# EAGLE design optical meter reader v3 (EAGLE 7.5.0)
Optical meter reader for Sensus water meters.
Assembly variants: Battery powered

## Sheet 1 of 2
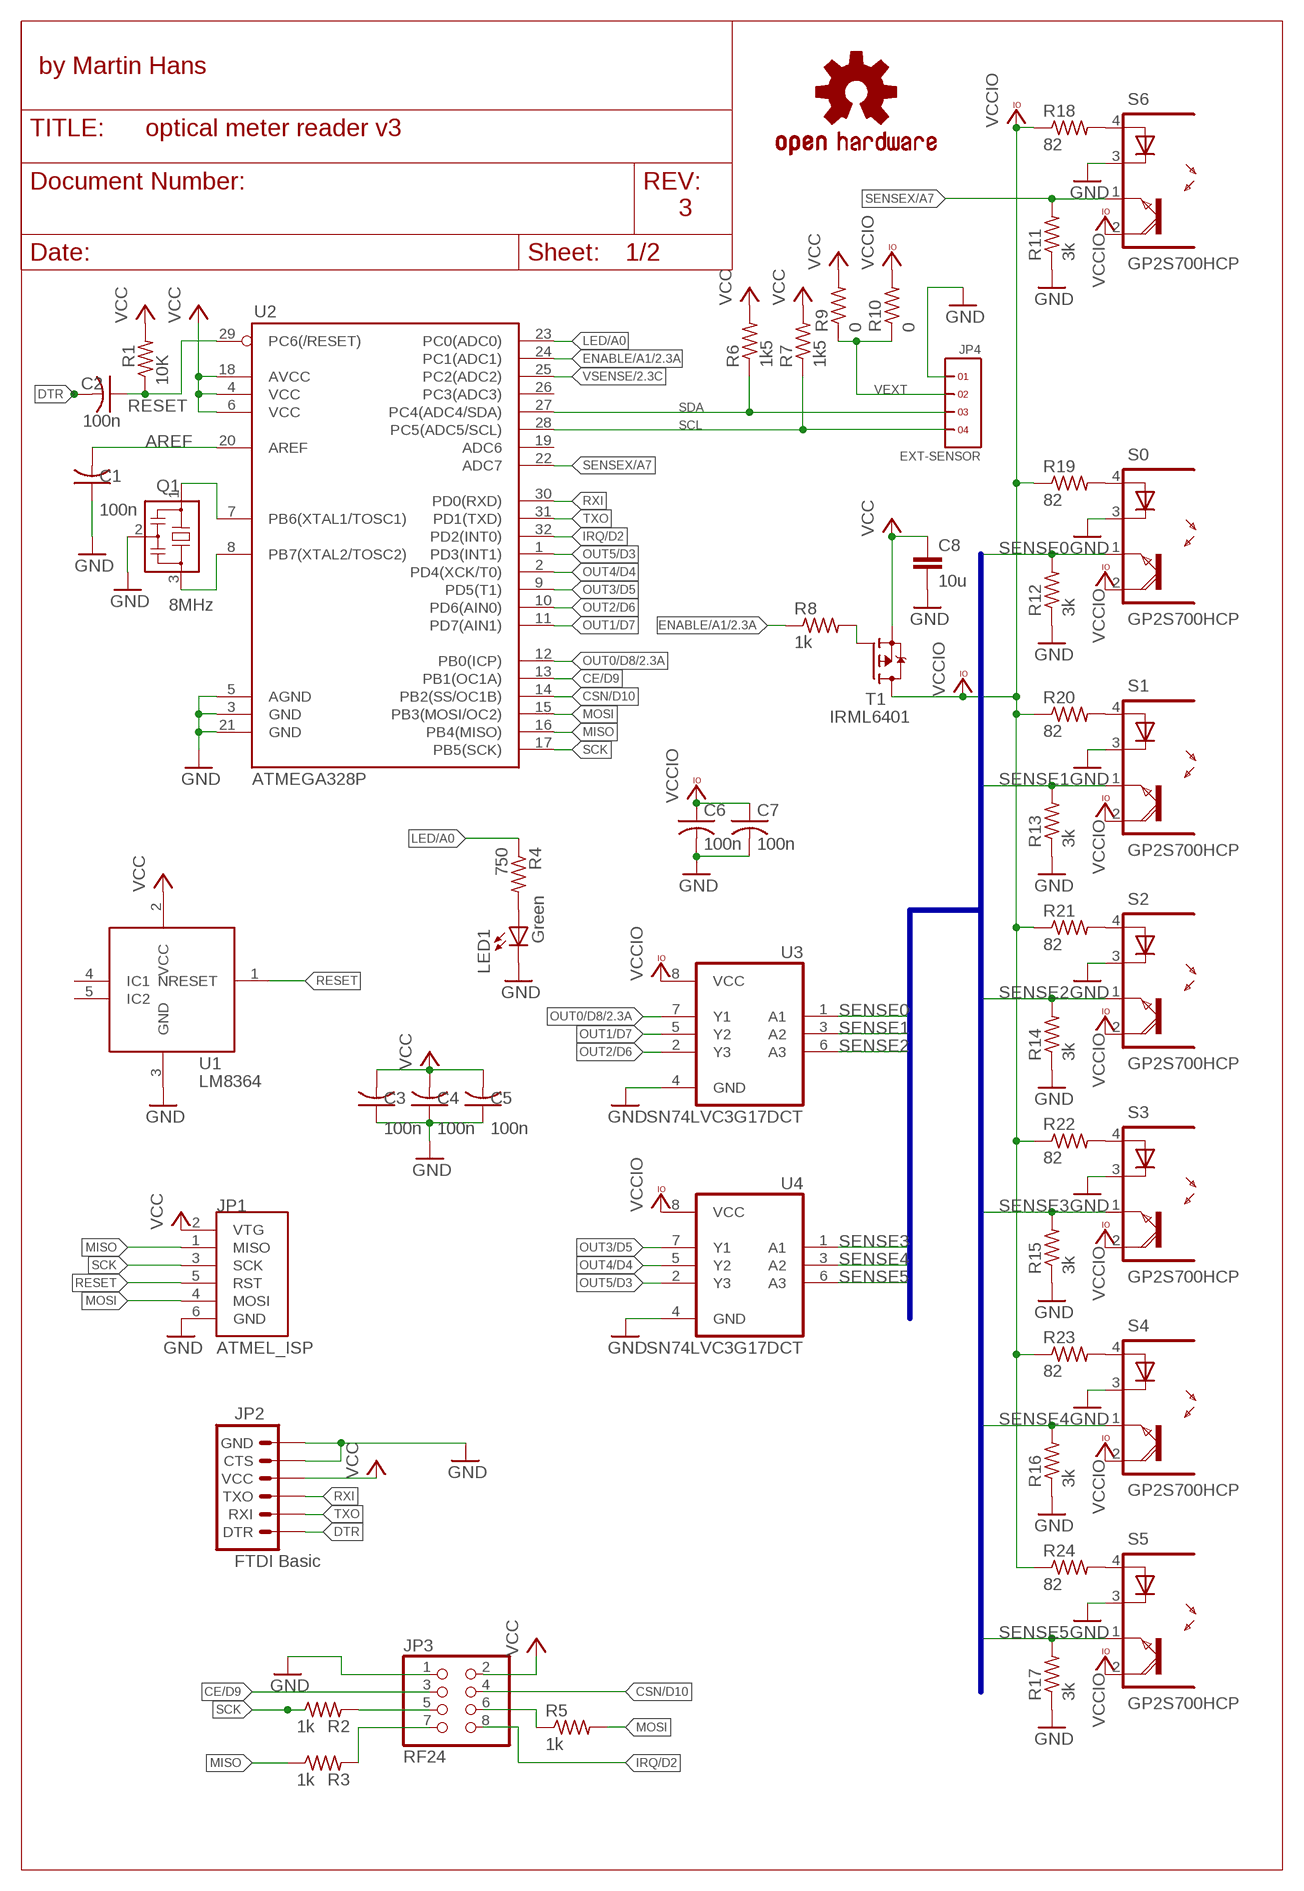
[diagram p0: schematic, sheet 1]

### Parts
C1  100n  C-USC0603  [C0603]
C2  100n  C-USC0603  [C0603]
C3  100n  C-USC0603  [C0603]
C4  100n  C-USC0603  [C0603]
C5  100n  C-USC0603  [C0603]
C6  100n  C-USC0603  [C0603]
C7  100n  C-USC0603  [C0603]
C8  10u  C-EUC0603  [C0603]
JP1  ATMEL_ISP  [2X03]  (not fitted in variant Battery powered)
JP2  FTDI Basic  ARDUINO_SERIAL_PROGRAMPTH  [1X06]
JP3  RF24  PINHD-2X4  [2X04]
JP4  EXT-SENSOR  1X4  [1X4]  (not fitted in variant Battery powered)
LED1  Green  LED  [0603-LED-ALT1]
LOGO1  OSHW-LOGOL  [OSHW-LOGO-L]
Q1  8MHz  CSTCE  [CSTCE]
R1  10K  R-US_R0603  [R0603]
R2  1k  R-US_R0603  [R0603]
R3  1k  R-US_R0603  [R0603]
R4  750  R-US_R0603  [R0603]
R5  1k  R-US_R0603  [R0603]
R6  1k5  R-US_R0603  [R0603]  (not fitted in variant Battery powered)
R7  1k5  R-US_R0603  [R0603]  (not fitted in variant Battery powered)
R8  1k  R-US_R0603  [R0603]
R9  0  R-US_R0603  [R0603]  (not fitted in variant Battery powered)
R10  0  R-US_R0603  [R0603]  (not fitted in variant Battery powered)
R11  3k  R-US_R0603  [R0603]  (not fitted in variant Battery powered)
R12  3k  R-US_R0603  [R0603]
R13  3k  R-US_R0603  [R0603]
R14  3k  R-US_R0603  [R0603]
R15  3k  R-US_R0603  [R0603]
R16  3k  R-US_R0603  [R0603]
R17  3k  R-US_R0603  [R0603]
R18  82  R-US_R0603  [R0603]  (not fitted in variant Battery powered)
R19  82  R-US_R0603  [R0603]
R20  82  R-US_R0603  [R0603]
R21  82  R-US_R0603  [R0603]
R22  82  R-US_R0603  [R0603]
R23  82  R-US_R0603  [R0603]
R24  82  R-US_R0603  [R0603]
S0  GP2S700HCP  [SMD]
S1  GP2S700HCP  [SMD]
S2  GP2S700HCP  [SMD]
S3  GP2S700HCP  [SMD]
S4  GP2S700HCP  [SMD]
S5  GP2S700HCP  [SMD]
S6  GP2S700HCP  [SMD]  (not fitted in variant Battery powered)
T1  IRML6401  [SOT23]
U1  LM8364  [SOT23-DBV]
U2  ATMEGA328P  ATMEGA168  [TQFP32-08]
U3  SN74LVC3G17DCT  SN743G17DCT  [SSOP08]
U4  SN74LVC3G17DCT  SN743G17DCT  [SSOP08]

### Nets
AREF: C1.2 U2.20(AREF)
CE/D9: JP3.3 U2.13(PB1(OC1A))
CSN/D10: JP3.4 U2.14(PB2(SS/OC1B))
DTR: C2.2 JP2.1(DTR)
ENABLE/A1: R8.1 U2.24(PC1(ADC1)) ; also sheet 2
GND: C1.1 C3.1 C4.1 C5.1 C6.2 C7.2 C8.2 JP1.6(GND) JP2.5(CTS) JP2.6(GND) JP3.1 JP4.1 LED1.C Q1.2 R11.1 R12.1 R13.1 R14.1 R15.1 R16.1 R17.1 S0.3(C) S1.3(C) S2.3(C) S3.3(C) S4.3(C) S5.3(C) S6.3(C) U1.3(GND) U2.3(GND) U2.5(AGND) U2.21(GND) U3.4(GND) U4.4(GND) ; also sheet 2
IRQ/D2: JP3.8 U2.32(PD2(INT0))
LED/A0: R4.1 U2.23(PC0(ADC0))
MISO: JP1.1(MISO) R3.1 U2.16(PB4(MISO))
MOSI: JP1.4(MOSI) R5.2 U2.15(PB3(MOSI/OC2))
N$1: R19.2 S0.4(A)
N$2: R20.2 S1.4(A)
N$3: R21.2 S2.4(A)
N$4: R22.2 S3.4(A)
N$5: R23.2 S4.4(A)
N$6: R18.2 S6.4(A)
N$7: R8.2 T1.1(G)
N$8: R24.2 S5.4(A)
N$9: LED1.A R4.2
N$10: Q1.3 U2.8(PB7(XTAL2/TOSC2))
N$11: Q1.1 U2.7(PB6(XTAL1/TOSC1))
N$12: JP3.6 R5.1
N$13: JP3.7 R3.2
N$14: JP3.5 R2.2
OUT0/D8: U2.12(PB0(ICP)) U3.7(Y1) ; also sheet 2
OUT1/D7: U2.11(PD7(AIN1)) U3.5(Y2)
OUT2/D6: U2.10(PD6(AIN0)) U3.2(Y3)
OUT3/D5: U2.9(PD5(T1)) U4.7(Y1)
OUT4/D4: U2.2(PD4(XCK/T0)) U4.5(Y2)
OUT5/D3: U2.1(PD3(INT1)) U4.2(Y3)
RESET: C2.1 JP1.5(RST) R1.1 U1.1(NRESET) U2.29(PC6(/RESET))
RXI: JP2.3(TXO) U2.30(PD0(RXD))
SCK: JP1.3(SCK) R2.1 U2.17(PB5(SCK))
SCL: JP4.4 R7.1 U2.28(PC5(ADC5/SCL))
SDA: JP4.3 R6.1 U2.27(PC4(ADC4/SDA))
SENSE0: R12.2 S0.1(EMI) U3.1(A1) ; also sheet 2
SENSE1: R13.2 S1.1(EMI) U3.3(A2)
SENSE2: R14.2 S2.1(EMI) U3.6(A3)
SENSE3: R15.2 S3.1(EMI) U4.1(A1)
SENSE4: R16.2 S4.1(EMI) U4.3(A2)
SENSE5: R17.2 S5.1(EMI) U4.6(A3)
SENSEX/A7: R11.2 S6.1(EMI) U2.22(ADC7)
TXO: JP2.2(RXI) U2.31(PD1(TXD))
VCC: C3.2 C4.2 C5.2 C8.1 JP1.2(VTG) JP2.4(VCC) JP3.2 R1.2 R6.2 R7.2 R9.2 T1.2(S) U1.2(VCC) U2.4(VCC) U2.6(VCC) U2.18(AVCC) ; also sheet 2
VCCIO: C6.1 C7.1 R10.2 R18.1 R19.1 R20.1 R21.1 R22.1 R23.1 R24.1 S0.2(COL) S1.2(COL) S2.2(COL) S3.2(COL) S4.2(COL) S5.2(COL) S6.2(COL) T1.3(D) U3.8(VCC) U4.8(VCC)
VEXT: JP4.2 R9.1 R10.1
VSENSE: U2.25(PC2(ADC2)) ; also sheet 2
Unconnected: U1.4(IC1) U1.5(IC2) U2.19(ADC6) U2.26(PC3(ADC3))

### Buses
SENSE[0..5]

### Notes on the sheet
- by Martin Hans
- 3

## Sheet 2 of 2
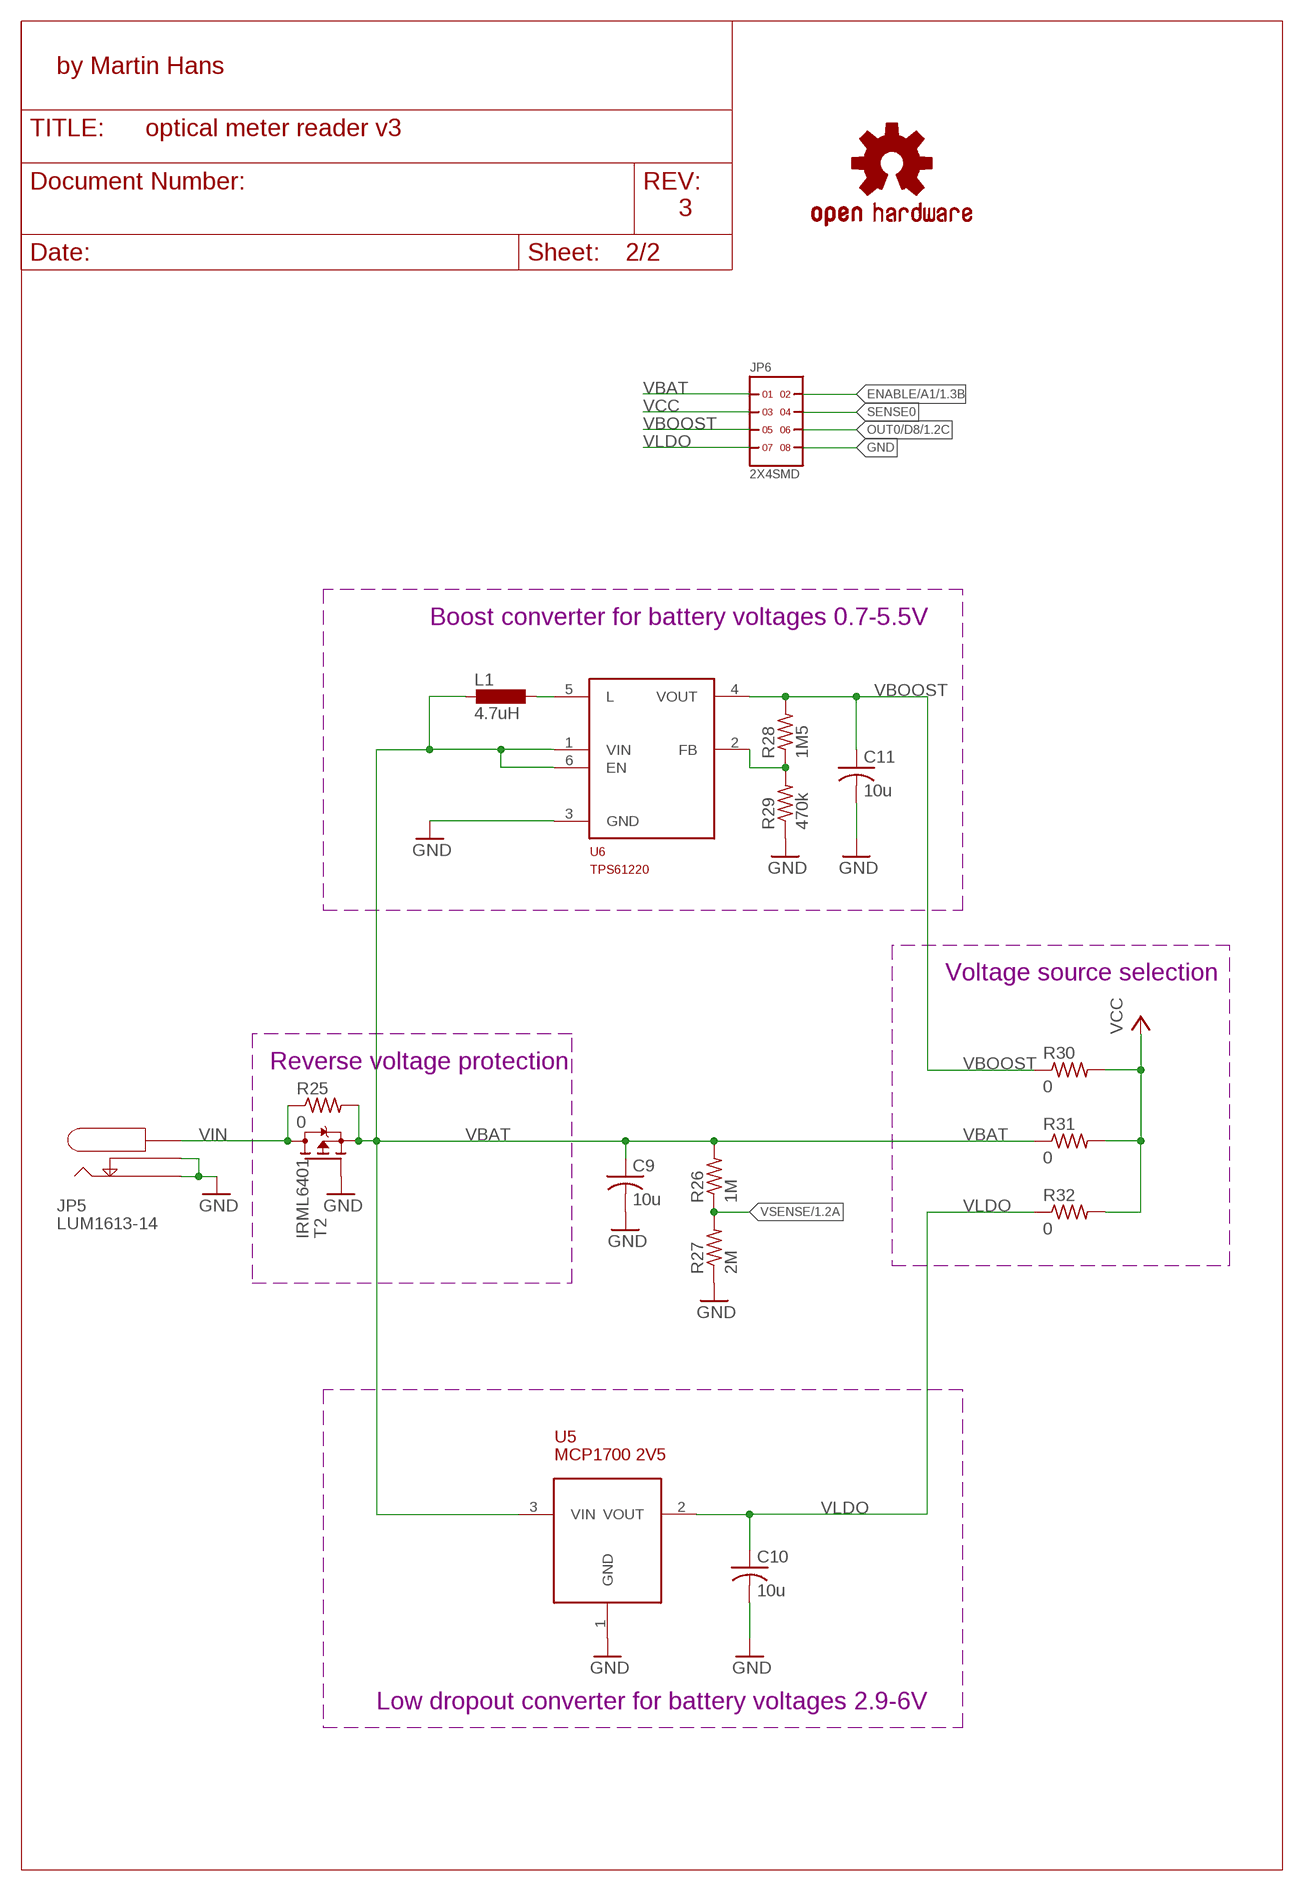
[diagram p1: schematic, sheet 2]

### Parts
C9  10u  C-USC0603  [C0603]
C10  10u  C-USC0603  [C0603]
C11  10u  C-USC0603  [C0603]  (not fitted in variant Battery powered)
JP5  LUM1613-14  [1613-14]
JP6  2X4SMD  [2X4_SMD]
L1  4.7uH  EPL3015  [EPL3015]  (not fitted in variant Battery powered)
LOGO2  OSHW-LOGOL  [OSHW-LOGO-L]
R25  0  R-US_R0603  [R0603]  (not fitted in variant Battery powered)
R26  1M  R-US_R0603  [R0603]
R27  2M  R-US_R0603  [R0603]
R28  1M5  R-US_R0603  [R0603]  (not fitted in variant Battery powered)
R29  470k  R-US_R0603  [R0603]  (not fitted in variant Battery powered)
R30  0  R-US_R0603  [R0603]  (not fitted in variant Battery powered)
R31  0  R-US_R0603  [R0603]  (not fitted in variant Battery powered)
R32  0  R-US_R0603  [R0603]
T2  IRML6401  [SOT23]
U5  MCP1700 2V5  MCP1700  [SOT23]
U6  TPS61220  [DCK-R_PDSO_G6]  (not fitted in variant Battery powered)

### Nets
ENABLE/A1: JP6.2 ; also sheet 1
FB: R28.1 R29.2 U6.2(FB)
GND: C9.2 C10.2 C11.2 JP5.1(SHIELD) JP5.2(CONNECT) JP6.8 R27.1 R29.1 T2.1(G) U5.1(GND) U6.3(GND) ; also sheet 1
L: L1.P$2 U6.5(L)
OUT0/D8: JP6.6 ; also sheet 1
SENSE0: JP6.4 ; also sheet 1
VBAT: C9.1 JP6.1 L1.P$1 R25.2 R26.2 R31.1 T2.2(S) U5.3(VIN) U6.1(VIN) U6.6(EN)
VBOOST: C11.1 JP6.5 R28.2 R30.1 U6.4(VOUT)
VCC: JP6.3 R30.2 R31.2 R32.2 ; also sheet 1
VIN: JP5.3@1(CENTER) JP5.3@2(CENTER) R25.1 T2.3(D)
VLDO: C10.1 JP6.7 R32.1 U5.2(VOUT)
VSENSE: R26.1 R27.2 ; also sheet 1

### Notes on the sheet
- by Martin Hans
- 3
- Boost converter for battery voltages 0.7-5.5V
- Voltage source selection
- Reverse voltage protection
- Low dropout converter for battery voltages 2.9-6V

## Library data of the parts
C1-C7 = rcl:C-US: CAPACITOR, American symbol
C8 = rcl:C-EU: CAPACITOR, European symbol
C9-C11 = adafruit:C-US: CAPACITOR, American symbol
JP1 = connectors:ATMEL_ISP
JP2 = SparkFun:ARDUINO_SERIAL_PROGRAM
JP3 = pinhead:PINHD-2X4: PIN HEADER
JP4 = headers(2mm):1X4
JP5 = connectors:LUM1613-14: Lumberg 1613 12 DC power connector Diameter opening 6.5mm Diameter center pin 2.0 mm Nominal power 2.5A Nominal voltage 13.5 V DC Mating connectors: 1633 02, NES/J 21, NES/J 210, NES/J 21 W, XNES/J 210
JP6 = headers(2mm):2X4
L1 = my-inductors:EPL3015: Small inductor from Coilcraft
LED1 = Testing:LED: LEDs Standard schematic elements and footprints for 5mm, 3mm, 1206, and 0603 sized LEDs. 5mm - Spark Fun Electronics SKU : COM-00529 (and others)
LOGO1 LOGO2 = SparkFun-Aesthetics:OSHW-LOGO: Open Source Hardware Logo This logo indicates the piece of hardware it is found on incorporates a OSHW license and/or adheres to the definition of open source hardware found here: http://freedomdefined.org/OSHW
Q1 = oscillators:CSTCE: Murata CSTCE SMD Type Ceramic Resonators Frequency: 8.00 to 13.99MHz Size: 3.2 x 1.3 x 0.8mm
R1-R32 = adafruit:R-US_: RESISTOR, American symbol
S0 S1-S6 = optoelectronics:GP2S700HCP
T1 T2 = my-transistors:IRML6401
U1 = power_supply:LM8364: LM8364 Micropower Undervoltage Sensing Circuits The LM8364 series are micropower undervoltage sensing circuits that are ideal for use in battery powered microprocessor based systems, where extended battery life is a key requirement. A range of threshold voltages from 2.0V to 4.5V are available with an active low open drain output. These devices feature a very low quiescent current of 0.65µA typical. The LM8364 series features a highly accurate voltage reference, a comparator with precise thresholds and built-in hysterisis to prevent erratic reset operation, and ensured Reset operation down to 1.0V with extremely low standby current. These devices are available in the space saving SOT-23 5-pin surface mount package. For other undervoltage thresholds and output options, please contact Texas Instruments.
U2 = SparkFun:ATMEGA168
U3 U4 = logic:SN74*3G17
U5 = power_supply:MCP1700
U6 = power_supply:TPS61220

## Net classes
0 default: clearance 0.205 mm
1 vcc: width 0.254 mm

## Board
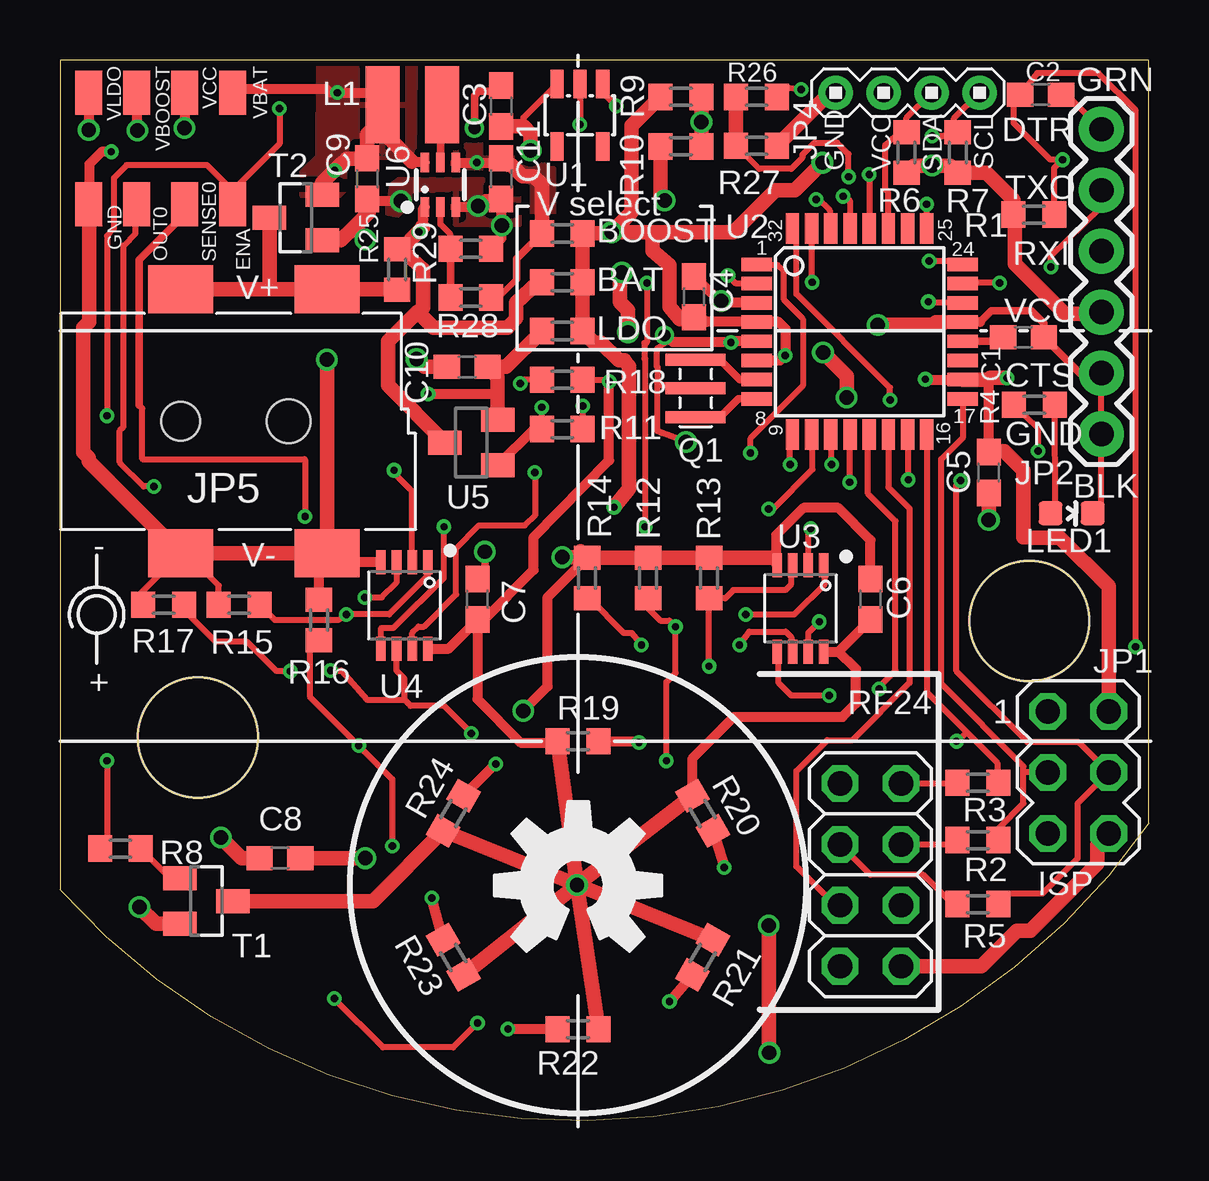
[diagram p2: board, top side]
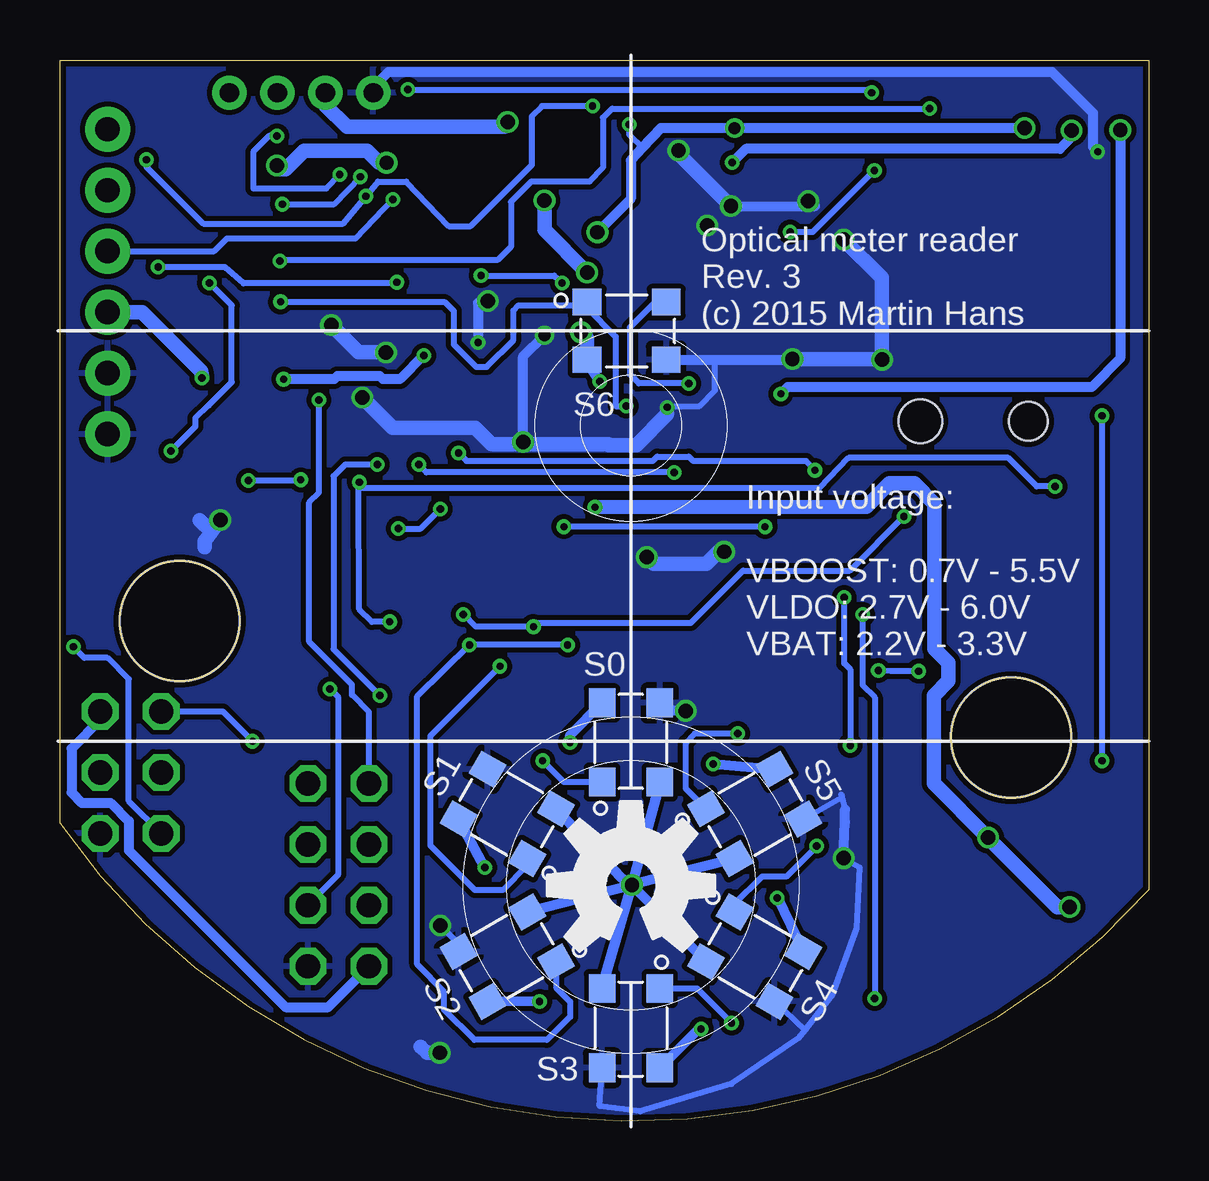
[diagram p3: board, bottom side, seen from below]

Size 45.4 x 44.21 mm. Coordinates in mm from the lower left corner, seen from the top.
Outline: 45.4,12.4 45.39,44.21 0,44.21 0,9.63 arc103 45.4,12.4
Outline: circle at 40.41,20.83 radius 2.5
Outline: circle at 5.75,15.97 radius 2.5
Copper layers (1*16): Top 0.035mm / dielectric 1.5mm / Bottom 0.035mm
Design rules "SeeedStudio_2layer_DRU_no_angle_20140221": minimum track width 6mil, minimum drill 12mil, track to track 6mil, track to pad 6mil, pad to pad 6mil, via to via 6mil, smd to smd 0mil, copper to edge 10mil, drill to drill 10mil, minimum pad ring 10mil, minimum via ring 6mil, stop-mask expansion 2mil, vias tented up to drill 100mil, thermal gap 10mil
Holes 5 mm at 5.75,15.97 40.41,20.83

### Footprints (pad centres in the part's own frame; a part is rotated, then mirrored left to right if it is on the bottom)
C0603 = smd 1.1 x 1: 1 -0.85,0; 2 0.85,0
2X03 = drill 1.016 octagon: 1 -1.27,2.54; 2 1.27,2.54; 3 -1.27,0; 4 1.27,0; 5 -1.27,-2.54; 6 1.27,-2.54
1X06 = drill 1.016 pad 1.88: 1 0,0; 2 2.54,0; 3 5.08,0; 4 7.62,0; 5 10.16,0; 6 12.7,0
2X04 = drill 1.016 octagon: 1 -3.81,-1.27; 2 -3.81,1.27; 3 -1.27,-1.27; 4 -1.27,1.27; 5 1.27,-1.27; 6 1.27,1.27; 7 3.81,-1.27; 8 3.81,1.27
1X4 = drill 0.8 pad 1.422: 1 -3,0; 2 -1,0; 3 1,0; 4 3,0
1613-14 = smd 2.7 x 2: 1 5,-5.5; 2 11.1,-5.5; 3@1 5,5.5; 3@2 11.1,5.5 | hole 1.6: 5,0 | hole 1.8: 9.5,0
2X4_SMD = smd 1.12 x 1.83: 1 0,0; 3 2,0; 4 2,4.65; 5 4,0; 6 4,4.65; 7 6,0; 8 6,4.65 | smd 1.12 x 1.82: 2 0,4.65
EPL3015 = smd 1.42 x 3.2: P$1 -0.2,0; P$2 2.28,0
0603-LED-ALT1 = smd 1 x 1: A 0,-0.877; C 0,0.877
CSTCE = smd 0.5 x 2.5: 1 -1.2,0; 2 0,0; 3 1.2,0
R0603 = smd 1 x 1.1: 1 -0.85,0; 2 0.85,0
SMD = smd 1.2 x 1.1: 1 -1.7,1.2; 2 -1.7,-1.2; 3 1.6,-1.2; 4 1.6,1.2
SOT23 = smd 1 x 1.4: 1 -0.95,-1.1; 2 0.95,-1.1; 3 0,1.1
SOT23-DBV = smd 0.55 x 1.2: 1 -0.95,-1.3; 2 0,-1.3; 3 0.95,-1.3; 4 0.95,1.3; 5 -0.95,1.3
TQFP32-08 = smd 1.27 x 0.559: 1 -4.293,2.8; 2 -4.293,2; 3 -4.293,1.2; 4 -4.293,0.4; 5 -4.293,-0.4; 6 -4.293,-1.2; 7 -4.293,-2; 8 -4.293,-2.8; 17 4.293,-2.8; 18 4.293,-2; 19 4.293,-1.2; 20 4.293,-0.4; 21 4.293,0.4; 22 4.293,1.2; 23 4.293,2; 24 4.293,2.8 | smd 0.559 x 1.27: 9 -2.8,-4.293; 10 -2,-4.293; 11 -1.2,-4.293; 12 -0.4,-4.293; 13 0.4,-4.293; 14 1.2,-4.293; 15 2,-4.293; 16 2.8,-4.293; 25 2.8,4.293; 26 2,4.293; 27 1.2,4.293; 28 0.4,4.293; 29 -0.4,4.293; 30 -1.2,4.293; 31 -2,4.293; 32 -2.8,4.293
SSOP08 = smd 0.4 x 1: 1 -0.975,-1.8; 2 -0.325,-1.8; 3 0.325,-1.8; 4 0.975,-1.8; 5 0.975,1.8; 6 0.325,1.8; 7 -0.325,1.8; 8 -0.975,1.8
DCK-R_PDSO_G6 = smd 0.35 x 0.8: 1 -0.65,-0.925; 2 0,-0.925; 3 0.65,-0.925; 4 0.65,0.925; 5 0,0.925; 6 -0.65,0.925

### Placement (x,y rotation side)
C1  40.16,32.66 180 top
C2  40.87,42.77 0 top
C3  18.39,42.29 90 top
C4  26.42,34.34 270 top
C5  38.71,27.02 90 top
C6  33.79,21.74 90 top
C7  17.4,21.74 90 top
C8  9.17,10.94 0 top
C9  12.81,39.26 270 top
C10  16.97,31.42 180 top
C11  18.39,39.26 270 top
JP1  42.45,14.52 0 top
JP2  43.41,41.32 270 top
JP3  33.79,10.26 90 top
JP4  35.34,42.85 0 top
JP5  0.03,29.16 0 top
JP6  7.19,42.85 180 top
L1  13.64,42.34 0 top
LED1  42.17,25.32 270 top
LOGO1  21.59,9.82 0 top
LOGO2  21.59,9.82 0 bottom
Q1  26.5,30.53 270 top
R1  40.59,37.77 180 top
R2  38.26,11.71 180 top
R3  38.26,14.09 180 top
R4  40.62,29.84 0 top
R5  38.26,9.04 0 top
R6  35.29,40.36 270 top
R7  37.42,40.36 270 top
R8  2.52,11.35 0 top
R9  25.89,42.67 180 top
R10  25.89,40.61 180 top
R11  20.93,28.82 0 top
R12  24.52,22.63 270 top
R13  27.06,22.63 270 top
R14  21.98,22.63 270 top
R15  7.47,21.51 0 top
R16  10.8,20.87 270 top
R17  4.32,21.51 0 top
R18  20.93,30.89 180 top
R19  21.59,15.82 0 top
R20  26.79,12.82 300 top
R21  26.79,6.82 240 top
R22  21.59,3.82 180 top
R23  16.4,6.82 120 top
R24  16.4,12.82 60 top
R25  14.05,35.48 90 top
R26  29.04,42.67 0 top
R27  29.04,40.64 180 top
R28  17.12,34.31 0 top
R29  17.12,36.34 180 top
R30  20.93,36.98 0 top
R31  20.93,34.95 0 top
R32  20.93,32.91 0 top
S0  21.59,15.82 90 bottom
S1  26.79,12.82 150 bottom
S2  26.79,6.82 210 bottom
S3  21.59,3.82 270 bottom
S4  16.4,6.82 330 bottom
S5  16.4,12.82 30 bottom
S6  21.72,32.92 0 bottom
T1  6.1,9.17 270 top
T2  9.83,37.64 90 top
U1  21.67,41.91 180 top
U2  33.33,32.89 0 top
U3  30.87,21.36 180 top
U4  14.36,21.48 180 top
U5  17.15,28.27 90 top
U6  15.85,39.01 0 top

### Tracks (layer width: path | path; a pad name or v marks a point on that pad's centre or on a via)
AREF
  Top 0.305: U2.20 39.14,32.49 C1.2
CE/D9  (via drill 0.3)
  Top 0.254: v34.14,18 34.22,18.16 34.83,18.77 34.83,24.99 33.68,26.13 33.68,28.55 U2.13
  Bottom 0.254: JP3.3 35.06,9.01 33.79,10.28 33.79,17.65 v34.14,18
CSN/D10
  Top 0.254: U2.14 34.53,26.41 35.41,25.52 35.41,18.26 33.02,15.87 31.98,15.87 30.69,14.58 30.69,10.61 32.31,8.99 JP3.4
DTR
  Top 0.254: C2.2 41.99,42.74 JP2.1
ENABLE/A1  (via drill 0.3)
  Top 0.254: v36.22,35.84 37.54,35.84 U2.24 | JP6.2 7.19,38.76 | 7.19,38.76 6.13,39.82 2.77,39.82 2.24,39.29 2.24,37.18 1.96,36.88 v1.96,29.38 | v9.15,42.19 9.15,40.71 7.19,38.76 | v1.96,15.01 1.96,11.64 R8.1
  Bottom 0.254: v36.22,35.84 36.17,35.89 27.13,35.89 26.6,36.42 26.6,38.3 25.76,39.14 23.32,39.14 22.76,39.72 22.76,41.8 22.38,42.19 v9.15,42.19 | v1.96,29.38 v1.96,15.01
FB
  Top 0.254: R29.2 16.27,36.94 15.85,37.36 U6.2
  Top 0.305: R29.2 R28.1 | 15.85,38.12 U6.2
GND  (via drill 0.3, 0.5, 0.6)
  Top 0.254: 29.57,23.48 U3.4 | R13.1 27.06,23.52 24.55,23.52 R12.1 | 43.36,28.57 JP2.6 | R11.1 v20.08,29.74 20.08,29.78 | 25.53,32.46 25.28,32.46 24.92,32.2 24.87,32.15 24.87,31.44 24.9,31.44 24.9,30.86 | Q1.2 26.37,30.65 25.1,30.65 24.9,30.86 | 24.9,30.86 24.9,28.75 25.07,28.67 v26.09,28.29 | 19.32,41.44 19.32,41.81 U1.3 | JP2.6 43.41,25.69 LED1.C | JP2.6 JP2.5 | R17.1 3.24,21.87 JP5.1 5.03,23.62 | R15.1 6.62,22.31 5.59,23.34
  Top 0.305: 29.85,23.2 U3.4 | C7.2 17.71,22.77 v17.71,23.72 | JP2.5 42.51,31.16 C1.1 41.01,33.23 40.49,33.75 38.82,33.75 38.36,33.3 | U2.21 | v27.97,32.44 27.9,32.46 | C11.2 18.39,37.33 v18.42,37.31
  Top 0.406: C8.2 10.4,10.95 | R14.1 20.32,21.83 20.32,18.11 v19.31,17.09 | 29.85,23.2 29.85,24.41 30.99,25.55 32.44,25.55 33.79,24.2 C6.2 33.8,22.58 | R29.1 18.39,36.76 C11.2 17.72,38.41 v17.43,38.12 17.39,38.09 U6.3 | v14.2,38.32 12.9,38.32 C9.2 | 38.36,33.3 36.89,33.27 | 36.89,33.27 U2.21 | U4.4 11.5,23.28 | 11.5,23.28 JP5.2 | R16.1 10.8,23.09 11.5,23.28 | 5.59,23.34 5.31,23.62 5.03,23.62 4.88,23.77 | C4.1 27.44,34.22 v27.57,34.17 27.64,34.09 U2.3 | U2.5 28.1,32.49 v27.97,32.44 | 27.9,32.46 25.53,32.46 | R11.1 19.76,28.83 U5.1 | 36.89,33.27 U2.21 | 25.15,32.79 v25.2,32.74 25.4,32.53 | v2.14,40.38 1.73,40.38 1.22,39.87 1.22,38.23 JP6.8
  Top 0.61: R14.1 R12.1 R13.1 29.57,23.48 | 10.4,10.95 v12.73,10.95 | 21.71,23.75 R14.1 | v20.93,23.49 21.96,23.49 R14.1 | T2.1 11.7,36.69 12.26,37.25 | 12.26,37.25 12.86,37.84 12.86,38.36 C9.2 | v11.13,31.72 JP5.2 JP5.1 1.19,27.49 1.19,27.64 0.97,27.86 0.97,33.04 1.22,33.3 1.22,38.25 1.12,38.35 | v11.13,31.72 | v12.73,36.72 12.73,36.78 12.26,37.25 | C10.2 15.19,31.42 v14.86,31.75 | JP3.1 38.41,6.45 39.88,7.92 40.44,7.92 43.24,10.71 43.24,11.5 JP1.6 | v32.8,30.15 32.8,31.03 v31.81,32.03 | v34.09,33.17 36.4,33.17 36.5,33.27 36.89,33.27 | C3.1 19.32,41.44 19.61,41.14 v19.61,40.43 | JP4.1 32.1,42.85 R27.1 | v29.54,8.15 29.54,2.87 v29.57,2.84 | C5.1 v38.71,25.04
  Bottom 0.254: S0.3 20.45,17.48 | 12.83,13.61 12.8,13.49 | 12.8,13.49 12.67,12.98 v12.73,10.95 12.07,10.56 12.2,8.02 13.21,5.23 14.35,3.78 | 14.35,3.78 14.61,3.45 17.4,1.55 21.21,0.4 22.9,0.62 S3.3 | S4.3 14.35,3.78 | S5.3 12.8,13.49 | 20.1,31.69 S6.3 | 20.1,29.79 18.75,29.79 18.09,30.45 18.09,31.54 18.27,31.72 | 25.89,28.19 25.96,28.29 v26.09,28.29 | S2.3 28.78,7.38 v29.54,8.15
  Bottom 0.305: v18.42,37.31 18.57,37.31
  Bottom 0.406: S2.3 28.96,6.88 | v12.73,10.95 12.67,12.47 12.67,12.98 | v14.2,38.32 14.13,38.25 14.05,38.25 13.92,38.12 v17.43,38.12 | v19.31,17.09 20.06,17.09 S0.3 | v27.57,34.17 27.97,34.08 v27.97,32.44 | S6.3 18.27,31.72 14.89,31.72 v14.86,31.75 | v26.09,28.29 26.09,31.87 v25.2,32.74 | v2.14,40.38 2.34,40.59 2.34,42.01 4.04,43.71 31.7,43.71 32.34,43.08 JP4.1
  Bottom 0.61: v17.71,23.72 17.89,23.77 18.44,23.21 20.65,23.21 v20.93,23.49 | v12.73,36.72 11.13,35.12 v11.13,31.72 11.16,31.75 v14.86,31.75 | v20.08,29.74 20.08,29.45 21.37,28.16 22.51,28.16 22.53,28.19 25.89,28.19 27.41,28.19 28.1,28.88 31.53,28.88 v32.8,30.15 | v31.81,32.03 32.95,32.03 v34.09,33.17 | v19.61,40.43 19.61,40.31 v17.43,38.12 | JP4.1 32.34,42.98 | 39.37,23.9 39.37,24.15 v38.71,25.04 39.12,24.58 39.58,25.04 | v29.57,2.84 30.1,2.84 30.36,3.09
  pour Bottom: 0.13,44.09 45.34,44.09 45.34,-0.23 0.13,-0.23
  pour Top: 19.16,37.36 19.13,38.86 17.89,38.86 17.66,39.21 14.1,39.21 13.82,39.01 13.72,38.35 13.62,37.84 14.08,37.74 14.58,38.25 14.58,38.76 16.36,38.76 16.36,38.5 16.34,37.36
IRQ/D2  (via drill 0.3)
  Top 0.254: v34.6,30.04 34.6,30.55 30.69,34.46 30.69,37.02 U2.32
  Bottom 0.254: JP3.8 32.52,17.04 33.23,17.75 33.23,18.18 35.01,19.96 35.01,25.78 34.6,26.18 v34.6,30.04
L
  Top 0.305: U6.5 15.85,42.31 L1.P$2
LED/A0  (via drill 0.3)
  Top 0.254: v39.17,34.92 37.65,34.92 U2.23 | 39.78,29.9 R4.1 40.77,28.86 v40.77,27.91
  Bottom 0.254: v39.17,34.92 38.23,33.98 38.23,30.78 39.2,29.82 39.76,29.28 39.76,28.93 v40.77,27.91
MISO  (via drill 0.3)
  Top 0.254: U2.16 36.13,17.87 37.8,16.2 | 37.8,16.2 39.07,14.93 39.07,14.13 R3.1 | v37.37,15.82 37.42,15.82 37.8,16.2
  Bottom 0.254: JP1.1 38.61,17.06 v37.37,15.82
MOSI  (via drill 0.3)
  Top 0.254: R5.2 39.11,9.48 40.96,9.48 42.42,10.94 42.42,13.23 JP1.4 42.45,15.79 40.31,15.79 37.37,18.74 37.37,26.51 v37.55,26.69 | v35.36,26.72 35.36,28.56 U2.15
  Bottom 0.254: v37.55,26.69 35.39,26.69 v35.36,26.72
N$1  (via drill 0.3)
  Top 0.406: R19.2 24.08,15.82 v24.13,15.77
  Bottom 0.406: v24.13,15.77 24.13,16.08 S0.4
N$2  (via drill 0.3)
  Top 0.406: R20.2 v27.69,10.56
  Bottom 0.406: v27.69,10.56 S1.4
N$3  (via drill 0.3)
  Top 0.406: R21.2 v25.4,4.97
  Bottom 0.406: v25.4,4.97 S2.4
N$4  (via drill 0.3)
  Top 0.406: R22.2 v18.67,3.82 v18.67,3.83
  Bottom 0.406: v18.67,3.83 18.78,3.83 S3.4
N$5  (via drill 0.3)
  Top 0.406: R23.2 v15.5,9.29
  Bottom 0.406: v15.5,9.29 S4.4
N$6  (via drill 0.3)
  Top 0.254: 20.07,30.87 R18.2 19.34,30.89 v19.18,30.73
  Bottom 0.254: S6.4 20.59,34.12 21.65,33.07 21.65,31.11 21.26,30.73 v19.18,30.73
N$7
  Top 0.254: T1.1 4.6,10.12 R8.2
N$8  (via drill 0.3)
  Top 0.406: R24.2 v18.17,14.88
  Bottom 0.406: v18.17,14.88 S5.4
N$9
  Top 0.254: R4.2 41.49,25.52 LED1.A
N$10
  Top 0.254: 27.51,29.33 Q1.3
  Top 0.305: U2.8 28.27,30.09 27.51,29.33
N$11
  Top 0.254: 27.51,31.73 Q1.1
  Top 0.305: U2.7 28.35,30.89 27.51,31.73
N$12
  Top 0.254: R5.1 37.22,9.04 36,10.26 33.79,10.26 JP3.6
N$13
  Top 0.254: JP3.7 37.38,14.07 R3.2
N$14
  Top 0.254: JP3.5 37.23,11.53 R2.2
OUT0/D8  (via drill 0.3)
  Top 0.254: U3.7 31.19,20.34 v31.65,20.8 | JP6.6 3.19,37.58 3.15,37.54 3.15,36.98 2.65,36.47 2.65,28.93 2.49,28.77 2.49,27.43 3.48,26.44 v3.92,26.44 | v32.92,26.62 32.92,28.82 U2.12
  Bottom 0.254: v3.92,26.44 4.68,26.44 5.87,27.63 12.53,27.63 13.75,26.36 32.95,26.36 | v31.65,20.8 32.39,20.8 32.92,21.33 32.95,26.36 | 32.95,26.36 v32.92,26.62
OUT1/D7  (via drill 0.3)
  Top 0.254: U2.11 32.13,27.38 v32.16,27.35 | v32.06,17.73 30.48,17.73 29.95,18.26 29.95,19.5 U3.5
  Bottom 0.254: v32.16,27.35 33.51,27.35 33.99,26.87 33.99,19.66 v32.06,17.73
OUT2/D6  (via drill 0.3)
  Top 0.254: U3.2 31.19,24.58 v31.3,24.68 | v29.54,25.5 29.72,25.5 31.37,27.15 31.37,28.55 U2.10
  Bottom 0.254: v31.3,24.68 30.36,24.68 v29.54,25.5
OUT3/D5  (via drill 0.3)
  Top 0.254: U4.7 14.68,20.34 14.94,20.6 15.17,20.6 16.51,21.94 16.51,23.87 17.45,24.81 19.38,24.81 19.82,25.24 19.82,27.05 v19.79,27.02 | v30.43,27.35 30.43,28.5 U2.9
  Bottom 0.254: v19.79,27.02 30.13,27.02 v30.43,27.35
OUT4/D4  (via drill 0.3)
  Top 0.254: v16.01,24.76 16.01,22.63 13.9,20.54 13.39,20.54 13.38,20.48 U4.5 | U2.2 28.18,34.89 v27.84,35.23 | 24.46,24.79 v24.39,24.76 | v24.39,24.76 24.46,24.76 | v24.46,34.92 24.46,32.46 24.44,32.41 24.36,32.41 24.36,31.77 24.39,31.77 v24.39,24.76
  Bottom 0.254: v16.01,24.76 v24.39,24.76 | v27.84,35.23 24.79,35.23 v24.46,34.92
OUT5/D3  (via drill 0.3)
  Top 0.254: U4.2 14.68,26.24 13.9,27.02 v13.93,27.11 | U2.1 29.07,35.66 29.93,35.66 30.18,35.43 30.18,34.21 30.97,33.42 30.97,30.63 28.78,28.44 v28.78,27.83
  Bottom 0.254: v13.93,27.11 14.29,27.5 19,27.5 19.18,27.68 20.5,27.68 20.68,27.5 28.45,27.5 v28.78,27.83
RESET  (via drill 0.3)
  Top 0.254: v32.64,38.53 32.75,38.5 32.92,38.35 32.92,37.42 U2.29 | v44.84,19.76 44.84,42.11 43.29,43.66 40.73,43.66 C2.1 39.76,42.73 39.76,41.58 41.28,40.05 v41.79,40.05 41.44,39.71 R1.1 | U1.1 22.62,42.86 v23.19,42.29
  Bottom 0.254: JP1.5 42.52,13.33 42.52,18.41 43.41,19.3 44.38,19.3 v44.84,19.76 | v23.19,42.29 25.3,42.29 25.73,41.86 25.73,39.82 28.27,37.28 29.19,37.28 30.97,39.14 32.14,39.14 v32.64,38.53 33.58,37.38 39.43,37.38 41.79,39.75 v41.79,40.05
RXI  (via drill 0.3)
  Top 0.254: v31.53,38.4 31.58,38.45 32.08,37.94 32.08,37.23 U2.30
  Bottom 0.254: JP2.3 38.97,36.24 38.43,36.78 33.08,36.78 v31.53,38.4
SCK
  Top 0.254: R2.1 39.11,12.17 40.16,13.23 40.16,14.58 | 37.39,30.09 U2.17 37.65,30.06 37.65,28.49 36.73,27.58 36.73,18.21 40.16,14.78 40.16,14.58 | JP1.3 40.21,14.52 40.16,14.58
SCL  (via drill 0.3)
  Top 0.254: R7.1 36.77,41.03 v36.35,41.04 | v33.74,39.44 33.74,37.42 U2.28 | 37.27,41.23 37.27,41.78 JP4.4
  Top 0.305: 37.27,41.23 R7.1
  Bottom 0.254: v36.35,41.04 36.68,41.04 37.34,40.38 37.34,38.86 34.29,38.86 v33.74,39.44
SDA
  Top 0.254: R6.1 35.27,41.03 | U2.27 34.52,37.42 34.52,38.68 34.4,38.83 34.4,40.66 34.85,41.04 34.99,41.07 R6.1 | R6.1 35.29,41.8 JP4.3
  Top 0.305: 35.27,41.07 R6.1
SENSE0  (via drill 0.3)
  Top 0.254: R12.2 24.52,21.36 25.02,20.85 25.4,20.85 v25.66,20.6 25.66,18.67 25.28,18.28 v25.28,15.01 | U3.1 31.88,23.12 31.88,22.37 30.61,21.1 v28.58,21.1 | JP6.4 5.19,37.67 | 3.31,29.82 3.43,29.69 3.43,27.58 10.19,27.58 10.22,27.56 v10.22,25.19 10.27,25.32
  Top 0.305: 5.19,37.67 5.09,37.67 3.31,35.89 3.31,29.82
  Bottom 0.254: S0.1 24.39,14.12 v25.28,15.01 | v28.58,21.1 28.07,20.6 v25.66,20.6 25.51,20.75 19.11,20.75 16.92,22.93 12.48,22.93 v10.22,25.19
SENSE1  (via drill 0.3)
  Top 0.254: U3.3 30.48,23.1 30.48,22.37 30.23,22.12 28.07,22.12 27.73,21.78 R13.2 v27.06,18.94
  Bottom 0.254: S1.1 25.92,10.63 26.93,9.62 28.1,9.62 29.95,11.48 29.95,16.05 v27.06,18.94
SENSE2  (via drill 0.3)
  Top 0.254: R14.2 22.06,21.78 23.5,20.34 23.83,20.34 v24.24,19.83 | U3.6 30.48,19.61 30.48,20.16 30.26,20.39 28.73,20.39 v28.33,19.83
  Bottom 0.254: v24.24,19.83 v28.33,19.83 30.51,17.7 30.51,6.52 29.39,5.38 29.39,4.64 28.12,3.37 25.1,3.37 24.13,4.34 24.13,4.97 24.72,5.56 S2.1
SENSE3  (via drill 0.3)
  Top 0.254: U4.1 15.33,22.71 13.72,21.1 v11.94,21.1 11.61,20.87 8.96,20.87 R15.2 | v17.4,4.09 16.39,3.07 13.47,3.07 v11.43,5.1
  Bottom 0.254: S3.1 18.84,5.52 v17.4,4.09 | v11.94,21.1 11.94,18.16 11.43,17.65 v11.43,5.1
SENSE4  (via drill 0.3)
  Top 0.254: U4.3 14.03,22.43 13.42,21.81 v12.7,21.81 | R16.2 10.41,19.99 10.41,17.69 v12.45,15.64 13.85,14.25 v13.85,11.45
  Bottom 0.254: v12.45,15.64 12.45,18.82 12.7,19.07 v12.7,21.81 | v13.85,11.45 15.12,10.18 16.13,10.18 17.27,9.04 S4.1
SENSE5  (via drill 0.3)
  Top 0.254: v17.15,16.15 16.01,17.29 14.61,17.29 14.36,17.55 | 14.36,17.55 14.36,18.44 14.03,18.76 U4.6 | v11.28,18.77 11.74,18.77 12.81,17.55 14.36,17.55 | v9.61,18.74 9.02,18.74 7.8,19.96 6.49,19.96 5.17,21.28 R17.2
  Bottom 0.254: S5.1 19.31,13.85 19.31,15.77 18.93,16.15 v17.15,16.15 | v9.61,18.74 10.77,18.74 v11.28,18.77
SENSEX/A7  (via drill 0.3)
  Top 0.254: U2.22 36.24,34.09 v36.2,34.13 | v21.8,29.79 v21.78,29.79 R11.2
  Bottom 0.254: 23.44,34.13 S6.1 | v36.2,34.13 29.37,34.13 28.99,33.75 28.99,32.36 28.05,31.42 27.61,31.42 26.5,32.53 26.5,33.78 26.29,33.98 23.56,33.98 S6.1 | S6.1 23.42,33.88 22.23,32.69 22.23,29.79 v21.8,29.79
TXO  (via drill 0.3)
  Top 0.254: v31.35,34.95 31.35,37.16 | v41.3,35.58 41.3,36.04 43.41,38.07 JP2.2
  Top 0.305: 31.35,37.16 U2.31
  Bottom 0.254: 31.4,34.9 37.75,34.9 38.51,35.58 v41.3,35.58
  Bottom 0.305: 31.4,34.9 v31.35,34.95
VBAT  (via drill 0.3)
  Top 0.254: v30.89,42.97 30.27,43.05 R26.2 | U6.6 14.65,39.94 14.23,40.36 | v14.95,37.04 14.95,37.37 15.14,37.56
  Top 0.305: 13.79,42.1 L1.P$1
  Top 0.406: 15.14,37.23 15.14,37.56 15.14,38.02 U6.1 | L1.P$1 13.72,42.85 v11.56,42.85 11.26,42.85 11.1,43 7.35,43 JP6.1 | 14.69,39.98 15.16,39.98 U6.6
  Top 0.61: T2.2 10.93,39.09 v11.45,39.61 11.73,39.89 11.94,40.1 12.79,40.1 C9.1 12.81,41.12 13.79,42.1 13.79,40.88 14.69,39.98 | 15.14,37.23 v14.95,37.04 14.24,36.33 R25.2 14.22,36.33 15.14,35.48 15.14,33.88 14.9,33.71 | 14.9,33.71 13.67,32.48 13.67,30.65 U5.3 | R31.1 19.92,34.95 19,34.08 19,33.45 18.65,33.04 15.57,33.04 14.9,33.71
  Bottom 0.254: v30.89,42.97 11.74,42.97 v11.56,42.85 | v14.95,37.04 14.01,37.04 v11.45,39.61
  pour Top: 10.77,40.2 10.8,43.91 14.79,43.89 14.74,40.15 11.84,40.15 11.84,38.78 11.64,38.58 10.14,38.58 10.11,38.55 10.11,39.54
VBOOST  (via drill 0.3, 0.6)
  Top 0.254: R28.2 18.27,34.31 19.03,35.07
  Top 0.305: 19.03,35.07 19.03,35.92 R30.1
  Top 0.406: U6.4 v17.38,39.94 18.22,39.94 C11.1 18.48,40.03 | JP6.5 3.19,41.31 v3.23,41.27
  Top 0.61: R30.1 20.08,39.02 19.74,39.37 19.28,39.37 18.8,39.85 18.66,39.85 C11.1
  Bottom 0.406: v3.23,41.27 3.23,40.99 3.71,40.51 16.8,40.51 v17.38,39.94
  pour Top: 16.39,39.75 18.65,39.75 18.98,39.47 19.28,39.32 19.46,39.19 19.72,39.09 19.69,39.06 19.69,37.16 19.72,37.18 20.53,37.18 20.58,37.23 20.58,39.65 20.43,39.8 19.08,39.8 18.85,40.03 18.85,40.53 18.75,40.64 16.95,40.64 16.62,40.31 16.41,40.31
VCC  (via drill 0.3, 0.5, 0.6)
  Top 0.254: U1.2 v21.67,41.53
  Top 0.305: U2.18 | v17.28,41.37 17.28,42.72 17.45,42.9 18.15,42.9 C3.2
  Top 0.406: 22.94,36.98 v22.99,37.03 | JP6.3 5.19,41.28 v5.19,41.37 | U2.6 30.02,31.69 v30.23,31.9 30.26,31.92 30.26,32.99 29.95,33.3 U2.4 26.95,33.3 26.89,33.36 C4.2 | 43.34,33.63 JP2.4 | v36.07,30.91 36.09,30.89 U2.18 | C5.2 38.71,30.88
  Top 0.61: T1.2 4,8.22 v3.31,8.91 | 22.94,36.98 R30.2 R31.2 R32.2 22.27,32.43 22.56,32.43 23.3,31.7 23.52,31.7 23.73,31.44 23.73,26.34 v23.09,25.57 | U2.18 38.71,30.88 38.79,30.96 v39.48,30.96 | 24.71,37.03 v22.99,37.03 23.83,37.87 23.83,41.46 R9.2 | 24.71,37.03 24.71,36.26 25.4,35.66 25.4,33.93 25.84,33.4 26.36,33.4 C4.2 | JP1.2 43.72,22.27 41.69,24.3 40.44,24.3 40.16,24.33 40.16,27.12 39.37,27.91 38.75,27.91 C5.2 | 43.34,33.63 41.89,33.63 39.81,35.71 39.81,37.79 | 24.71,37.03 28.07,37.03 29.82,38.78 30.64,38.78 v31.78,39.92 | C8.1 7.57,10.94 v6.71,11.81 | R1.2 39.74,38.38 38.61,39.51 R7.2 37.11,39.81 v36.35,39.81 35.59,39.81 R6.2
  Bottom 0.254: v21.67,41.53 21.67,41.1 21.12,40.54 | 36.38,39.65 36.36,39.66 v36.35,39.81
  Bottom 0.406: v5.19,41.37 v17.28,41.37 20.35,41.37 21.12,40.54 21.59,40.03 21.59,38.43 v22.99,37.03 | v30.23,31.9 31.22,30.91 31.93,30.91 32.06,31.03 33.84,31.03 33.96,30.91 v36.07,30.91 | JP1.2 43.72,16.71 44.91,15.52 44.91,13.69 44.48,13.25 43.29,13.25 42.52,12.49 42.52,11.27 36,4.75 34.22,4.75 JP3.2
  Bottom 0.61: v3.31,8.91 3.81,8.91 v6.71,11.81 8.97,14.07 8.97,17.73 8.36,18.33 8.36,19.1 8.95,19.68 8.95,25.73 9.78,26.56 10.82,26.56 11.79,25.6 v23.09,25.57 | JP2.4 41.97,33.7 39.5,31.24 v39.48,30.96 | v31.78,39.92 32.08,39.92 32.59,40.43 35.21,40.43 36,39.65 36.38,39.65 36.4,39.67
VCCIO  (via drill 0.3, 0.6)
  Top 0.254: R18.1 22.91,30.89 v22.89,30.81
  Top 0.406: U4.8 16.2,19.68 C7.1 | U3.8 32.46,19.56 | 32.46,19.56 C6.1 | C7.1 17.4,17.57 19.21,15.77 20.69,15.77 R19.1 | 27.45,7.56 R21.1 | C7.1 17.67,20.89 19.74,22.96 19.74,24.33 22.89,27.53 v22.89,30.81 | 21.75,30.85 R18.1 | R20.1 26.37,15.11 28.1,16.84 32.62,16.84 33.18,17.4 33.18,18.84 32.46,19.56
  Top 0.61: v21.55,9.84 R24.1 13.05,9.17 T1.3 | v21.55,9.84 R21.1 | R23.1 v21.55,9.84 | R19.1 v21.55,9.84 | R22.1 v21.55,9.84 | R20.1 v21.55,9.84 | v23.68,32.86 23.68,33.78 23.35,34.11 23.35,35.28 v23.42,35.35 | R10.2 25.04,38.51 v25.2,38.35
  Bottom 0.254: 23.47,31.66 S6.2
  Bottom 0.406: v21.55,9.84 21.96,10.11 S1.2 | S0.2 v21.55,9.84 | S3.2 v21.55,9.84 | S2.2 v21.55,9.84 | S5.2 v21.55,9.84 | S4.2 v21.55,9.84 | v22.89,30.81 23.47,31.66
  Bottom 0.61: S6.2 23.42,32.61 v23.68,32.86 | v25.2,38.35 25.2,37.13 v23.42,35.35
VEXT  (via drill 0.6)
  Top 0.61: R9.1 v26.74,41.63 R10.1
  Bottom 0.61: JP4.2 34.34,42.33 33.43,41.42 26.86,41.42 v26.74,41.63
VIN
  Top 0.61: JP5.3@1 8.87,34.66 | 8.87,34.66 JP5.3@2 14.03,34.66 R25.1 | T2.3 8.73,34.79 8.87,34.66
VLDO  (via drill 0.3, 0.6)
  Top 0.406: JP6.7 v1.19,41.3 v1.2,41.3 | v15.35,30.3 18.05,30.3 18.25,30.1
  Top 0.61: U5.2 18.25,30.1 18.25,30.99 C10.1 18.59,31.42 R32.1
  Bottom 0.406: v1.2,41.3 1.2,31.77 2.39,30.58 15.07,30.58 v15.35,30.3
VSENSE  (via drill 0.3)
  Top 0.254: U2.25 36.13,38.24 v36.12,38.2 | R27.2 29.15,39.67 30.48,39.67 30.94,40.13 30.94,40.26 31.45,40.76 32.39,40.76 32.87,40.28 v32.87,39.34
  Top 0.61: R26.1 R27.2
  Bottom 0.254: v36.12,38.2 33.96,38.2 v32.87,39.34

### Text on the board
tPlace: VLDO | VBOOST | VCC | VBAT | GRN | DTR | SENSE0 | GND | VCC | SDA | SCL | GND | OUT0 | TXO | ENA | V select | BOOST | 1 | 32 | 25 | 24 | RXI | V+ | BAT | VCC | LDO | CTS | 8 | 9 | 16 | 17 | GND | BLK | - | V- | + | RF24 | 1 | ISP
bPlace: Optical meter reader / Rev. 3 / (c) 2015 Martin Hans | Input voltage: / / VBOOST: 0.7V - 5.5V / VLDO: 2.7V - 6.0V / VBAT: 2.2V - 3.3V